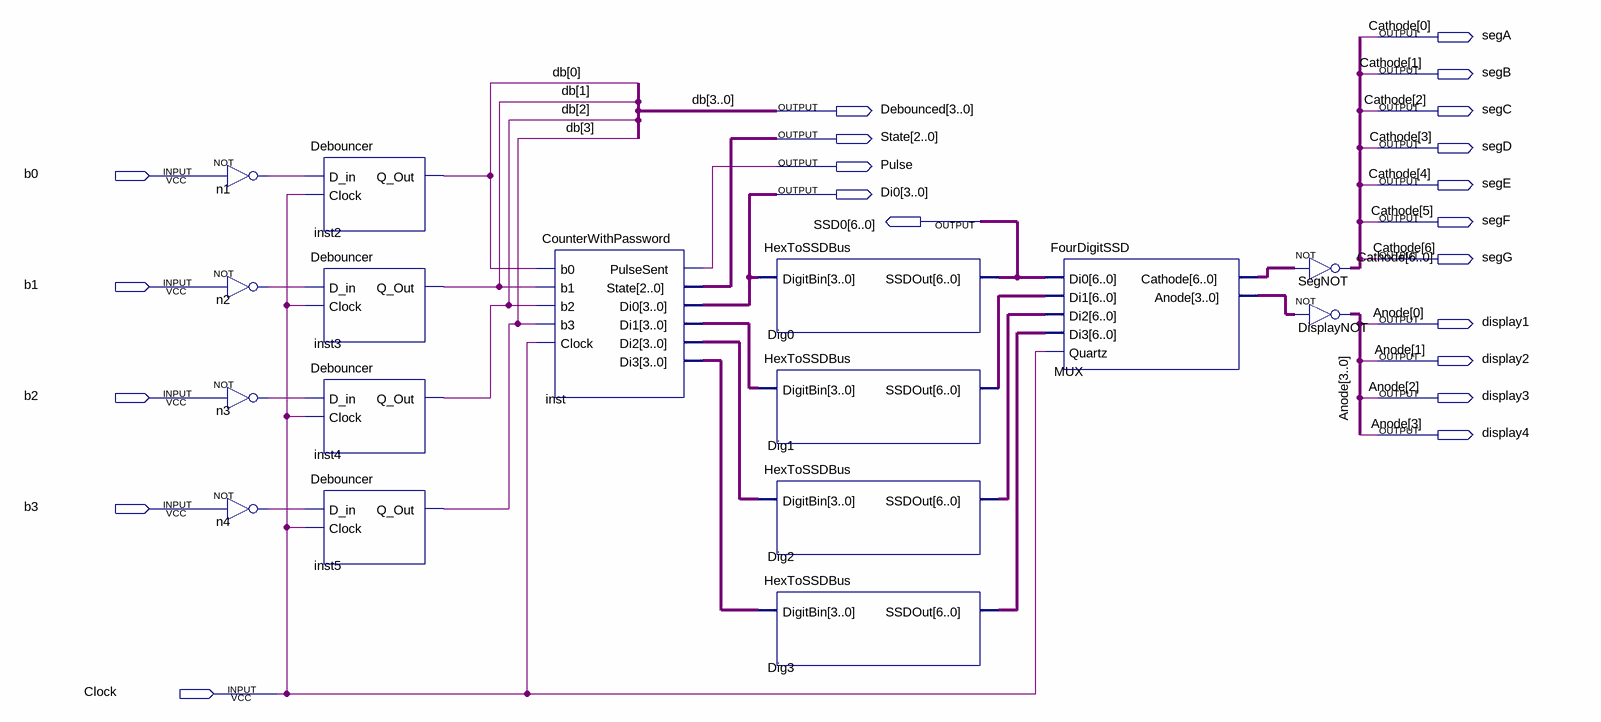
[diagram p0: schematic sheet]
// Quartus schematic FPGAPassword.bdf as structural Verilog: 16 symbols, 21 pins
module FPGAPassword (
  input  b0,
  input  b1,
  input  b2,
  input  b3,
  input  Clock,
  output segA,
  output segB,
  output [3:0] Debounced,
  output segC,
  output [2:0] State,
  output segD,
  output Pulse,
  output segE,
  output [3:0] Di0,
  output [6:0] SSD0,
  output segF,
  output segG,
  output display1,
  output display2,
  output display3,
  output display4
);

  wire n1_out, n2_out, n3_out, n4_out;
  wire [3:0] inst_di1, inst_di2, inst_di3, MUX_anode;
  wire [6:0] Dig1_ssdout, Dig2_ssdout, Dig3_ssdout, MUX_cathode;

  not n1 (n1_out, b0);
  not n2 (n2_out, b1);
  not n3 (n3_out, b2);
  not n4 (n4_out, b3);
  Debouncer inst2 (.D_in(n1_out), .Clock(Clock), .Q_Out(Debounced[0]));
  Debouncer inst3 (.D_in(n2_out), .Clock(Clock), .Q_Out(Debounced[1]));
  Debouncer inst4 (.D_in(n3_out), .Clock(Clock), .Q_Out(Debounced[2]));
  Debouncer inst5 (.D_in(n4_out), .Clock(Clock), .Q_Out(Debounced[3]));
  CounterWithPassword inst (
    .b0(Debounced[0]), .b1(Debounced[1]), .b2(Debounced[2]), .b3(Debounced[3]), .Clock(Clock),
    .PulseSent(Pulse), .State(State), .Di0(Di0), .Di1(inst_di1), .Di2(inst_di2), .Di3(inst_di3));
  HexToSSDBus Dig0 (.DigitBin(Di0), .SSDOut(SSD0));
  HexToSSDBus Dig1 (.DigitBin(inst_di1), .SSDOut(Dig1_ssdout));
  HexToSSDBus Dig2 (.DigitBin(inst_di2), .SSDOut(Dig2_ssdout));
  HexToSSDBus Dig3 (.DigitBin(inst_di3), .SSDOut(Dig3_ssdout));
  FourDigitSSD MUX (
    .Di0(SSD0), .Di1(Dig1_ssdout), .Di2(Dig2_ssdout), .Di3(Dig3_ssdout), .Quartz(Clock),
    .Cathode(MUX_cathode), .Anode(MUX_anode));
  assign {segG, segF, segE, segD, segC, segB, segA} = ~MUX_cathode;  // NOT SegNOT, 7 bits wide
  assign {display4, display3, display2, display1} = ~MUX_anode;  // NOT DisplayNOT, 4 bits wide

  // Other names for the same wires on the sheet: Anode[3:0] = {display4, display3, display2, display1};
  //   Cathode[6:0] = {segG, segF, segE, segD, segC, segB, segA}; db[3:0] = Debounced
endmodule
